# EAGLE design maplemini-r2 (EAGLE 5.11)
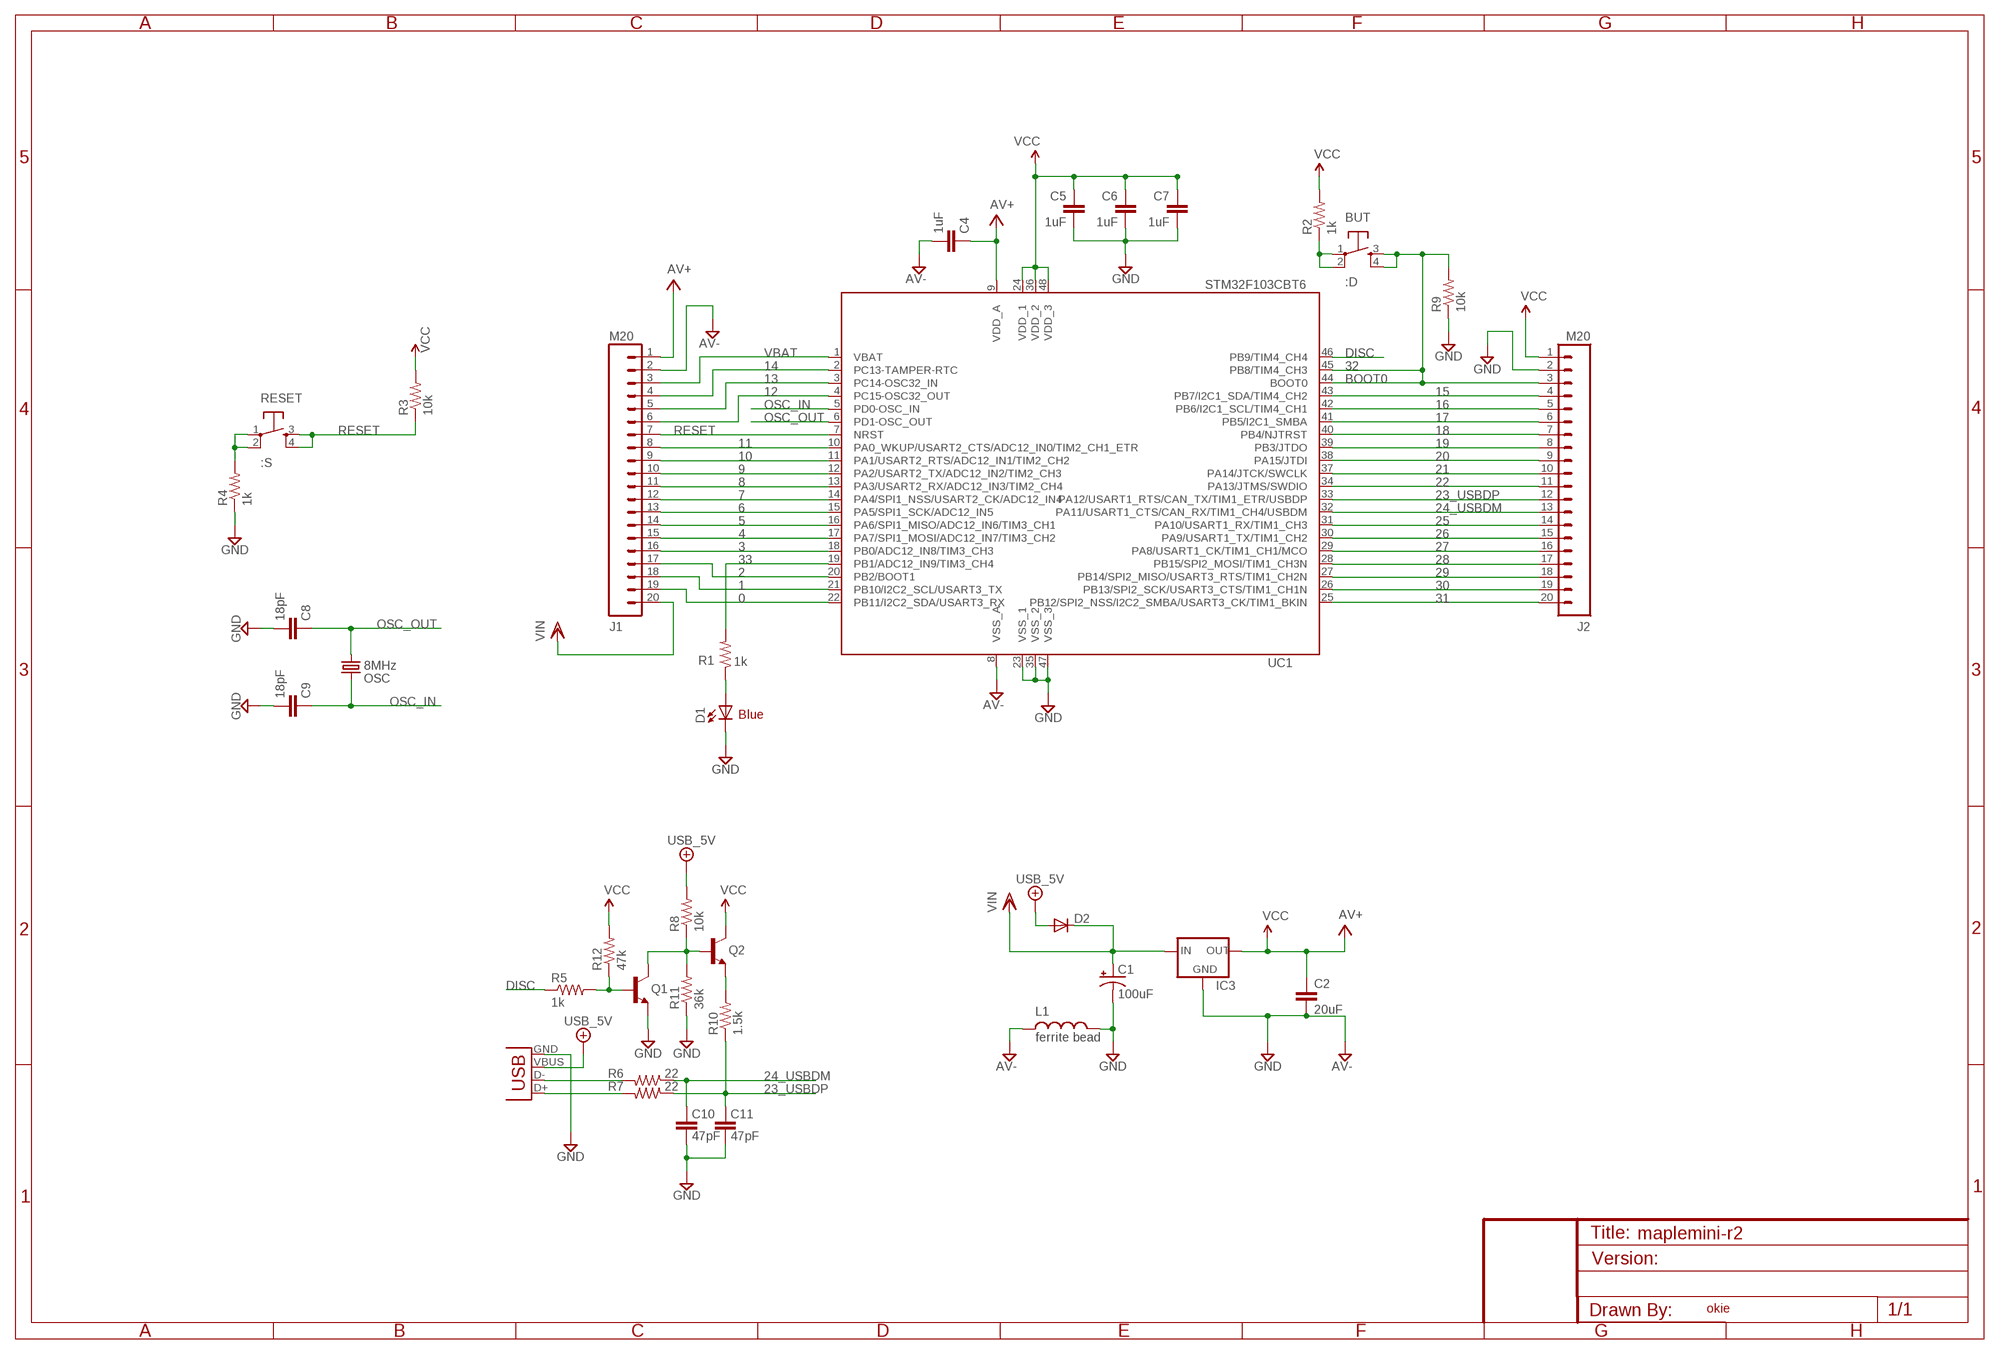
[diagram p0: schematic, sheet 1]

## Parts
BUT  :D  TAC_SWITCHPTH  [TACTILE-PTH]
C1  100uF  CAP_POLPTH2  [CPOL-RADIAL-10UF-25V]
C2  20uF  CAPPTH  [CAP-PTH-SMALL]
C4  1uF  CAP0603  [0603]
C5  1uF  CAP0603  [0603]
C6  1uF  CAP0603  [0603]
C7  1uF  CAP0603  [0603]
C8  18pF  CAP0603  [0603]
C9  18pF  CAP0603  [0603]
C10  47pF  CAP0603  [0603]
C11  47pF  CAP0603  [0603]
D1  Blue  LED3MM  [LED3MM]
D2  DIODE1N4148  [DIODE-1N4148]
IC3  MCP1700INLINE  [TO92-INLINE]
J1  M20  [1X20]
J2  M20  [1X20]
L1  ferrite bead  INDUCTOR0603  [0603]
OSC  8MHz  CRYSTALSMD  [HC49UP]
Q1  NPN-BJT  TRANSISTOR_NPNSOT23  [SOT23]
Q2  NPN-BJT  TRANSISTOR_NPNSOT23  [SOT23]
R1  1k  RESISTOR0603  [0603]
R2  1k  RESISTOR0603  [0603]
R3  10k  RESISTOR0603  [0603]
R4  1k  RESISTOR0603  [0603]
R5  1k  RESISTOR0603  [0603]
R6  22  RESISTOR0603  [0603]
R7  22  RESISTOR0603  [0603]
R8  10k  RESISTOR0603  [0603]
R9  10k  RESISTOR0603  [0603]
R10  1.5k  RESISTOR0603  [0603]
R11  36k  RESISTOR0603  [0603]
R12  47k  RESISTOR0603  [0603]
RESET  :S  TAC_SWITCHPTH  [TACTILE-PTH]
UC1  STM32F103CBT6  STM32F103CB  [LQFP48]
X1  USB-MINIB  USBPTH  [USB-B-PTH]

## Nets
0: J1.19 UC1.22(PB11/I2C2_SDA/USART3_RX)
1: J1.18 UC1.21(PB10/I2C2_SCL/USART3_TX)
2: J1.17 UC1.20(PB2/BOOT1)
3: J1.16 UC1.18(PB0/ADC12_IN8/TIM3_CH3)
4: J1.15 UC1.17(PA7/SPI1_MOSI/ADC12_IN7/TIM3_CH2)
5: J1.14 UC1.16(PA6/SPI1_MISO/ADC12_IN6/TIM3_CH1)
6: J1.13 UC1.15(PA5/SPI1_SCK/ADC12_IN5)
7: J1.12 UC1.14(PA4/SPI1_NSS/USART2_CK/ADC12_IN4)
8: J1.11 UC1.13(PA3/USART2_RX/ADC12_IN3/TIM2_CH4)
9: J1.10 UC1.12(PA2/USART2_TX/ADC12_IN2/TIM2_CH3)
10: J1.9 UC1.11(PA1/USART2_RTS/ADC12_IN1/TIM2_CH2)
11: J1.8 UC1.10(PA0_WKUP/USART2_CTS/ADC12_IN0/TIM2_CH1_ETR)
12: J1.6 UC1.4(PC15-OSC32_OUT)
13: J1.5 UC1.3(PC14-OSC32_IN)
14: J1.4 UC1.2(PC13-TAMPER-RTC)
15: J2.4 UC1.43(PB7/I2C1_SDA/TIM4_CH2)
16: J2.5 UC1.42(PB6/I2C1_SCL/TIM4_CH1)
17: J2.6 UC1.41(PB5/I2C1_SMBA)
18: J2.7 UC1.40(PB4/NJTRST)
19: J2.8 UC1.39(PB3/JTDO)
20: J2.9 UC1.38(PA15/JTDI)
21: J2.10 UC1.37(PA14/JTCK/SWCLK)
22: J2.11 UC1.34(PA13/JTMS/SWDIO)
23_USBDP: C11.2 J2.12 R7.1 R10.1 UC1.33(PA12/USART1_RTS/CAN_TX/TIM1_ETR/USBDP)
24_USBDM: C10.2 J2.13 R6.1 UC1.32(PA11/USART1_CTS/CAN_RX/TIM1_CH4/USBDM)
25: J2.14 UC1.31(PA10/USART1_RX/TIM1_CH3)
26: J2.15 UC1.30(PA9/USART1_TX/TIM1_CH2)
27: J2.16 UC1.29(PA8/USART1_CK/TIM1_CH1/MCO)
28: J2.17 UC1.28(PB15/SPI2_MOSI/TIM1_CH3N)
29: J2.18 UC1.27(PB14/SPI2_MISO/USART3_RTS/TIM1_CH2N)
30: J2.19 UC1.26(PB13/SPI2_SCK/USART3_CTS/TIM1_CH1N)
31: J2.20 UC1.25(PB12/SPI2_NSS/I2C2_SMBA/USART3_CK/TIM1_BKIN)
32: BUT.3 BUT.4 J2.3 R9.2 UC1.44(BOOT0) UC1.45(PB8/TIM4_CH3)
33: R1.2 UC1.19(PB1/ADC12_IN9/TIM3_CH4)
+5V/2: D2.A R8.2 X1.VBUS ; supply symbol labelled USB_5V
AV+: C4.1 J1.1 UC1.9(VDD_A)
AV-: C4.2 J1.2 L1.1 UC1.8(VSS_A)
DGND: C1.2(-) C2.2 C5.2 C6.2 C7.2 C8.2 C9.2 C10.1 C11.1 D1.K(C) IC3.1(GND) J2.2 L1.2 Q1.2(E) R4.1 R9.1 R11.1 UC1.23(VSS_1) UC1.35(VSS_2) UC1.47(VSS_3) X1.GND ; supply symbol labelled GND, AV-
DISC: R5.1 UC1.46(PB9/TIM4_CH4)
N$1: BUT.1 BUT.2 R2.1
N$2: D1.A R1.1
N$4: R4.2 RESET.1 RESET.2
N$51: Q2.2(E) R10.2
N$59: R6.2 X1.D-
N$60: R7.2 X1.D+
N$71: Q1.3(C) Q2.1(B) R8.1 R11.2
N$73: Q1.1(B) R5.2 R12.1
OSC_IN: C9.1 OSC.2 UC1.5(PD0-OSC_IN)
OSC_OUT: C8.1 OSC.1 UC1.6(PD1-OSC_OUT)
RESET: J1.7 R3.1 RESET.3 RESET.4 UC1.7(NRST)
VBAT: J1.3 UC1.1(VBAT)
VCC: C2.1 C5.1 C6.1 C7.1 IC3.3(OUT) J2.1 Q2.3(C) R2.2 R3.2 R12.2 UC1.24(VDD_1) UC1.36(VDD_2) UC1.48(VDD_3) ; supply symbol labelled AV+
VIN: C1.1(+) D2.C IC3.2(IN) J1.20

## Notes on the sheet
- BOOT0
- Blue
- okie

## Library data of the parts
BUT RESET = 3d2011:TAC_SWITCH: Momentary Switch Button commonly used for reset or general input. Spark Fun Electronics SKU : COM-00097
C1 = SparkFun3:CAP_POL: Capacitor Polarized These are standard SMD and PTH capacitors. Normally 10uF, 47uF, and 100uF in electrolytic and tantalum varieties. Always verify the external diameter of the through hole cap, it varies with capacity, voltage, and manufacturer. The EIA devices should be standard.
C2 = SparkFun2:CAP: Capacitor Standard 0603 ceramic capacitor, and 0.1" leaded capacitor.
C4-C11 = SparkFun:CAP: Capacitor Standard 0603 ceramic capacitor, and 0.1" leaded capacitor.
D1 = SparkFun:LED: LEDs Standard schematic elements and footprints for 5mm, 3mm, 1206, and 0603 sized LEDs. 5mm - Spark Fun Electronics SKU : COM-00529 (and others)
D2 = SparkFun3:DIODE: Diode These are standard reverse protection diodes and small signal diodes. SMA package can handle up to about 1A. SOD-323 can handle about 200mA. What the SOD-323 package when ordering, there are some mfgs out there that are 5-pin packages.
IC3 = adafruit:MCP1700: VOLTAGE REGULATOR
J1 J2 = SparkFun3:M20: This is just like the LOCK variant in that the holes are staggared by 5 mil, but except for the last two holes. They are not altered from the "standard" footprint layout. This is used for a special purpose on the layout of our Graphic LCD Backpack. Make sure you want to use this device before selecting it for you project!
L1 = SparkFun3:INDUCTOR: Inductors Basic Inductor/Choke - 0603 and 1206. Footprints are not proven and vary greatly between part numbers.
OSC = SparkFun2:CRYSTAL: Crystals Various standard crystals. Proven footprints. Spark Fun Electronics SKU : COM-00534
Q1 Q2 = SparkFun2:TRANSISTOR_NPN: Transistor NPN BJT configuration in SOT23 package. MMBT2222 is the common NPN we use. Double check BCE configuration again layout.
R1-R12 = SparkFun:RESISTOR: Resistor Basic schematic elements and footprints for 0603, 1206, and PTH 1/10th watt (small) resistors.
UC1 = stm32:STM32F103CB
X1 = SparkFun2:USB: USB Connectors USB-B-PTH is fully proven SKU : PRT-00139 USB-miniB is fully proven SKU : PRT-00587 USB-A-PCB is untested. USB-A-H is throughly reviewed, but untested. Spark Fun Electronics SKU : PRT-00437 USB-B-SMT is throughly reviewed, but untested. Needs silkscreen touching up. USB-A-S has not been used/tested USB-MB-H has not been used/tested

## Net classes
1 vcc: width 0.254 mm

## Board
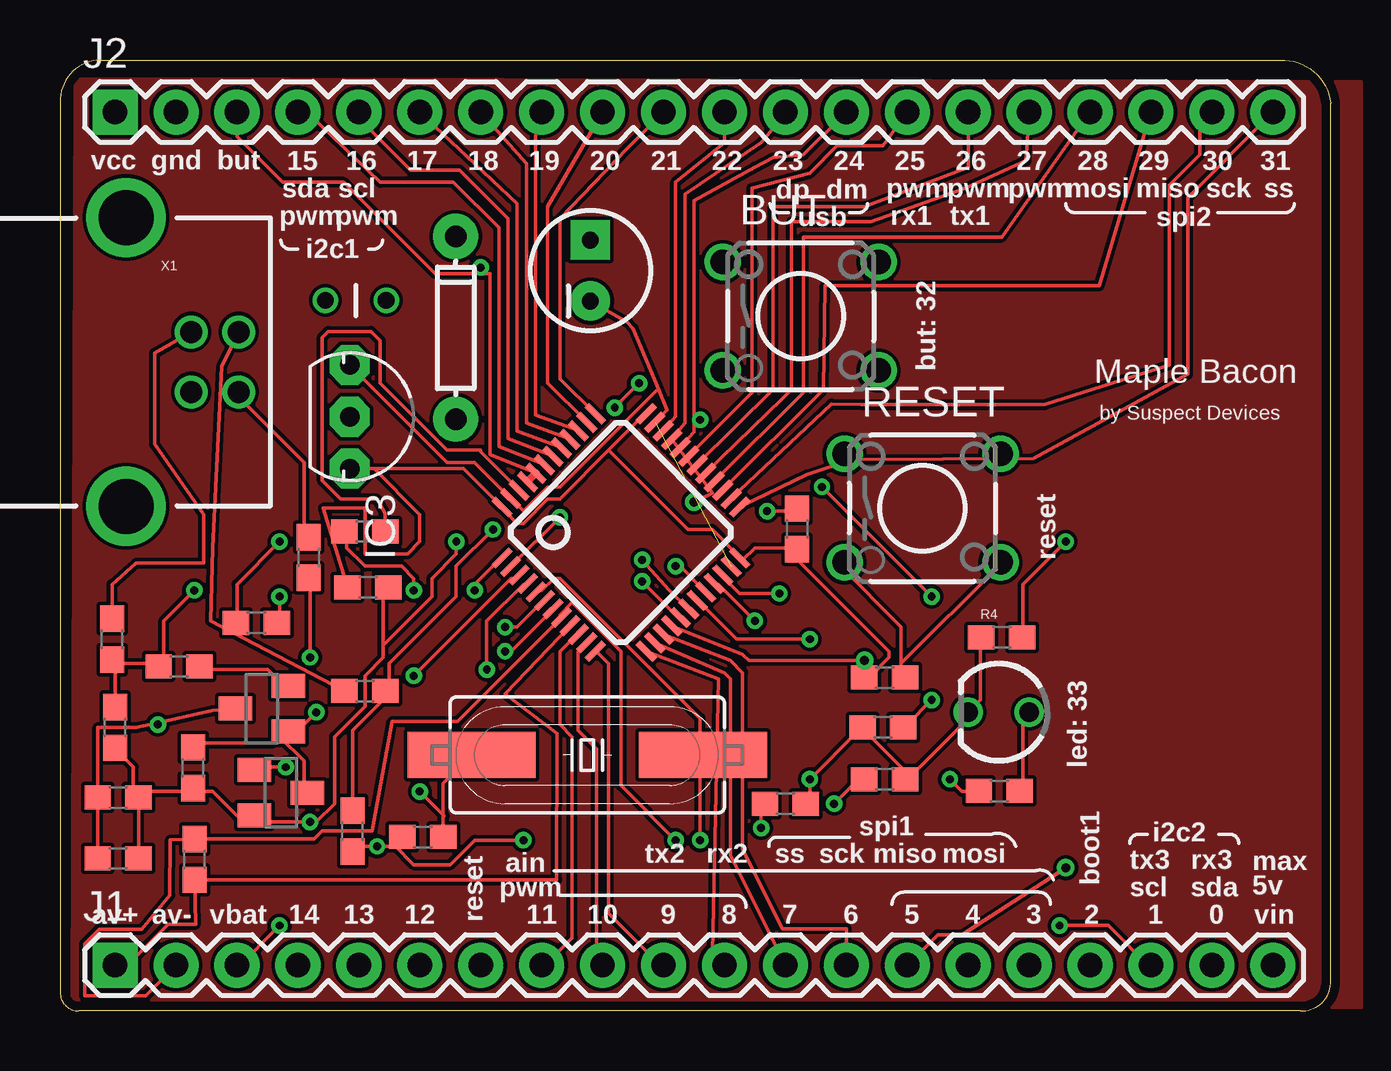
[diagram p1: board, top side]
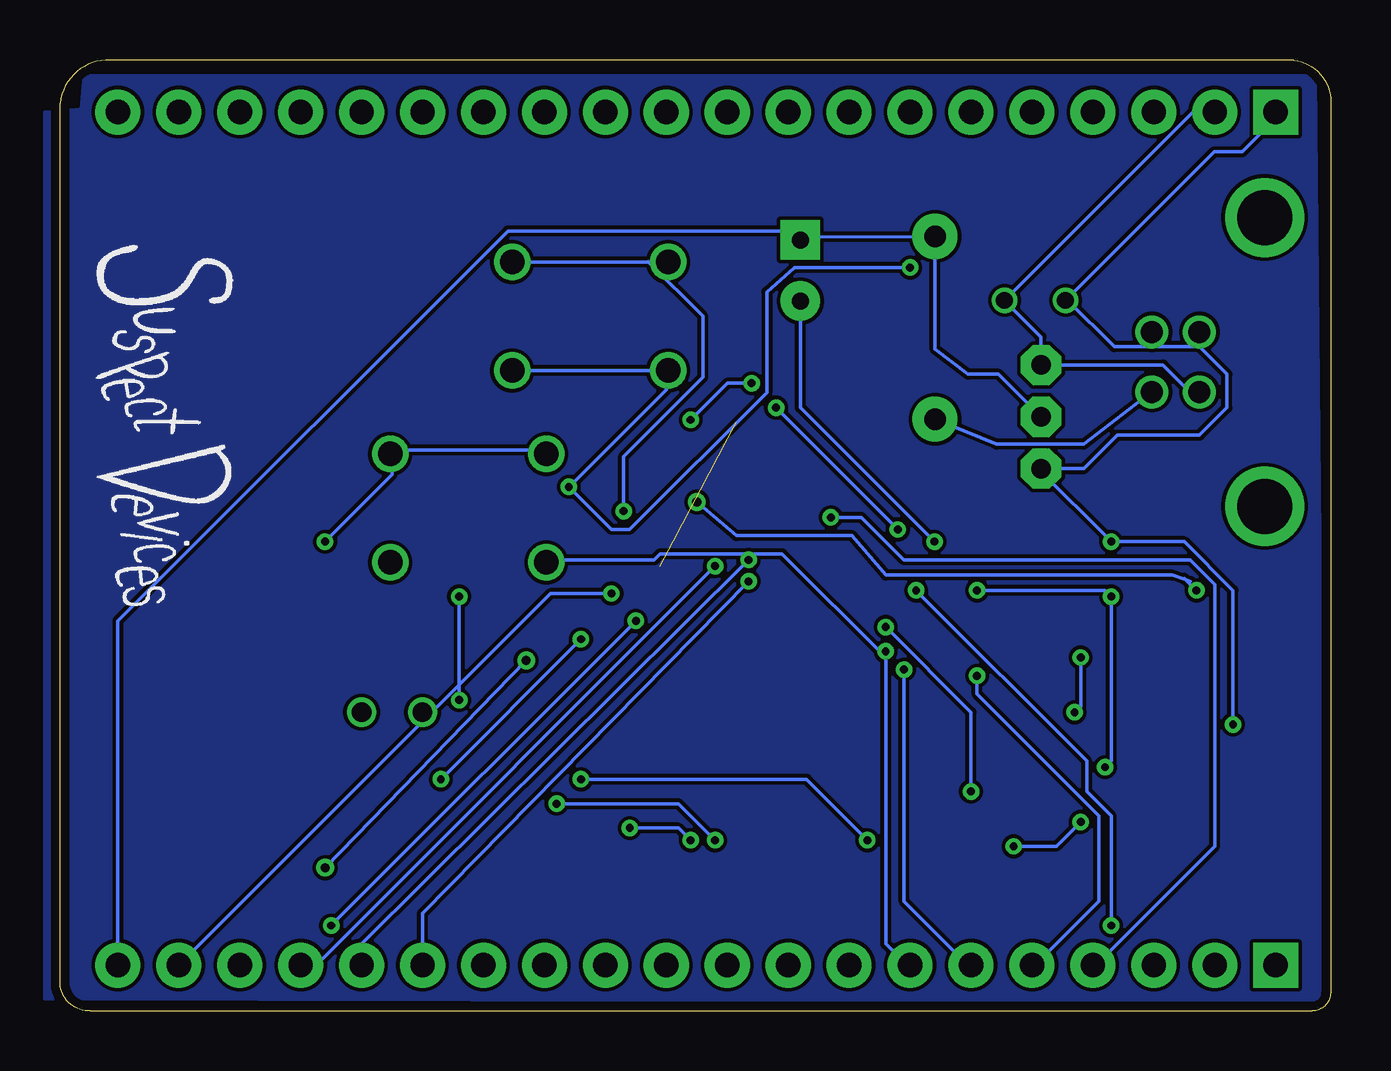
[diagram p2: board, bottom side, seen from below]

Size 52.97 x 39.64 mm. Coordinates in mm from the lower left corner, seen from the top.
Outline: 1.53,39.62 50.68,39.62 arc-90 52.97,37.85 52.97,1.14 arc-90 51.7,0 0.77,0 arc-90 0.01,0.76 0.01,37.72 arc-90 1.53,39.62
Copper layers (1*16): Top 0.0356mm / dielectric 1.5011mm / Bottom 0.0356mm
Design rules "LaenPCBOrder": minimum track width 6mil, minimum drill 13mil, track to track 6mil, track to pad 6mil, pad to pad 6mil, via to via 6mil, smd to smd 6mil, copper to edge 15mil, drill to drill 6mil, minimum pad ring 7mil, minimum via ring 7mil, stop-mask expansion 4mil, vias tented up to drill 0mil, thermal gap 10mil

### Footprints (pad centres in the part's own frame; a part is rotated, then mirrored left to right if it is on the bottom)
TACTILE-PTH = drill 1.016 round: 1 -3.251,2.261; 2 3.251,2.261; 3 -3.251,-2.261; 4 3.251,-2.261
CPOL-RADIAL-10UF-25V = drill 0.7 pad 1.651 square: 1 1.27,0 | drill 0.7 pad 1.651 round: 2 -1.27,0
CAP-PTH-SMALL = drill 0.7 round: 1 0,0; 2 2.54,0
0603 = smd 1.1 x 1: 1 -0.85,0; 2 0.85,0
LED3MM = drill 0.813 round: A -1.27,0; K 1.27,0
DIODE-1N4148 = drill 0.9 pad 1.88 round: A -3.81,0; C 3.81,0
TO92-INLINE = drill 0.813 pad 1.676 octagon: 1 -2.159,0; 2 0,0; 3 2.159,0
1X20 = drill 1.016 pad 1.88 square: 1 0,0 | drill 1.016 pad 1.88 round: 2 2.54,0; 3 5.08,0; 4 7.62,0; 5 10.16,0; 6 12.7,0; 7 15.24,0; 8 17.78,0; 9 20.32,0; 10 22.86,0; 11 25.4,0; 12 27.94,0; 13 30.48,0; 14 33.02,0; 15 35.56,0; 16 38.1,0; 17 40.64,0; 18 43.18,0; 19 45.72,0; 20 48.26,0
HC49UP = smd 5.334 x 1.93: 1 -4.826,0; 2 4.826,0
SOT23 = smd 1 x 1.4: 1 -0.95,-1.1; 2 0.95,-1.1; 3 0,1.1
LQFP48 = smd 0.254 x 1: 1 -2.75,-4.25; 2 -2.25,-4.25; 3 -1.75,-4.25; 4 -1.25,-4.25; 5 -0.75,-4.25; 6 -0.25,-4.25; 7 0.25,-4.25; 8 0.75,-4.25; 9 1.25,-4.25; 10 1.75,-4.25; 11 2.25,-4.25; 12 2.75,-4.25; 25 2.75,4.25; 26 2.25,4.25; 27 1.75,4.25; 28 1.25,4.25; 29 0.75,4.25; 30 0.25,4.25; 31 -0.25,4.25; 32 -0.75,4.25; 33 -1.25,4.25; 34 -1.75,4.25; 35 -2.25,4.25; 36 -2.75,4.25 | smd 1 x 0.254: 13 4.25,-2.75; 14 4.25,-2.25; 15 4.25,-1.75; 16 4.25,-1.25; 17 4.25,-0.75; 18 4.25,-0.25; 19 4.25,0.25; 20 4.25,0.75; 21 4.25,1.25; 22 4.25,1.75; 23 4.25,2.25; 24 4.25,2.75; 37 -4.25,2.75; 38 -4.25,2.25; 39 -4.25,1.75; 40 -4.25,1.25; 41 -4.25,0.75; 42 -4.25,0.25; 43 -4.25,-0.25; 44 -4.25,-0.75; 45 -4.25,-1.25; 46 -4.25,-1.75; 47 -4.25,-2.25; 48 -4.25,-2.75
USB-B-PTH = drill 0.914 round: D+ 0,1.25; D- 1.981,1.25; GND 0,-1.25; VBUS 1.981,-1.25 | drill 2.286 round: P$1 -2.718,-6.02; P$2 -2.718,6.02

### Placement (x,y rotation side)
BUT  30.87,28.96 0 top
C1  22.11,30.86 90 top
C2  11.06,29.62 0 top
C4  5.61,6.31 90 top
C5  12.84,17.65 0 top
C6  2.42,8.89 0 top
C7  2.42,6.35 0 top
C8  15.12,7.25 180 top
C9  30.24,8.64 0 top
C10  12.2,7.49 90 top
C11  2.3,11.81 90 top
D1  39.13,12.45 180 top
D2  16.49,28.47 90 top
IC3  12.08,24.77 270 top
J1  2.3,1.91 0 top
J2  2.3,37.47 0 top
L1  34.38,9.65 0 top
OSC  21.98,10.67 0 top
Q1  9.21,9.09 270 top
Q2  8.42,12.6 90 top
R1  39.15,9.17 180 top
R2  30.72,20.09 270 top
R3  34.38,13.89 180 top
R4  39.25,15.57 0 top
R5  12.71,19.99 180 top
R6  12.71,13.34 180 top
R7  2.17,15.49 90 top
R8  10.37,18.9 90 top
R9  34.3,11.81 0 top
R10  4.96,14.35 0 top
R11  5.55,10.14 90 top
R12  8.19,16.18 180 top
RESET  35.95,20.96 0 top
U$1  [SUSDEVLOGOSM]  51.19,32 270 bottom
UC1  23.38,19.94 315 top
X1  5.47,27.05 0 top

### Tracks (layer width: path | path; a pad name or v marks a point on that pad's centre or on a via)
0  (via drill 0.33)
  Top 0.152: UC1.22 27.62,18.11 28.33,17.4 v29.98,17.4
  Bottom 0.152: v29.98,17.4 32.52,17.4 J1.19
1  (via drill 0.33)
  Top 0.152: v28.97,16.26 27.44,17.78 UC1.21 | v41.67,3.56 43.7,3.56 45.48,1.78 J1.18
  Bottom 0.152: v41.67,3.56 v28.97,16.26
2  (via drill 0.33)
  Top 0.152: v25.66,18.54 25.84,18.54 UC1.20
  Bottom 0.152: J1.17 42.3,1.91 v25.66,18.54
3  (via drill 0.33)
  Top 0.152: v24.27,18.8 25.41,17.53 26.17,16.76 UC1.18
  Bottom 0.152: v24.27,18.8 40.4,2.79 J1.16
4  (via drill 0.33)
  Top 0.152: v24.27,17.91 25.66,16.51 UC1.17
  Bottom 0.152: v24.27,17.91 37.86,4.06 J1.15
5  (via drill 0.38)
  Top 0.152: v33.54,14.61 28.71,14.61 28.46,14.86 UC1.16 | v41.92,5.97 37.6,3.18 36.59,3.18 J1.14
  Bottom 0.152: v41.92,5.97 v33.54,14.61
6
  Top 0.152: J1.13 32.78,3.43 30.11,3.43 28.46,6.73 28.46,14.1 27.95,14.61 UC1.15
7
  Top 0.152: J1.12 27.95,6.48 27.95,13.84 27.7,14.1 UC1.14
8
  Top 0.152: J1.11 27.19,2.41 27.44,13.84 UC1.13
9
  Top 0.152: UC1.12 22.36,14.99 22.87,14.48 22.87,4.06 25.16,1.78 J1.10
10
  Top 0.152: UC1.11 21.85,15.24 21.6,14.99 21.6,11.68 22.36,10.92 22.36,2.29 22.62,2.03 J1.9
11
  Top 0.152: UC1.10 21.6,15.75 20.84,14.99 20.84,11.94 21.35,11.43 21.35,3.05 20.08,1.78 J1.8
12  (via drill 0.33)
  Top 0.152: v17.79,14.22 17.79,16.26 19.31,17.78 UC1.4
  Bottom 0.152: v17.79,14.22 17.79,4.57 15,1.78 J1.6
13  (via drill 0.33)
  Top 0.152: v14.74,13.97 18.81,18.03 19.06,18.03 UC1.3
  Bottom 0.152: v14.74,13.97 14.74,13.21 9.66,8.13 9.66,4.57 12.46,1.78 J1.5
14  (via drill 0.33)
  Top 0.152: v20.84,20.57 18.81,18.54 UC1.2
  Bottom 0.152: v20.84,20.57 19.57,20.57 17.79,18.8 5.85,18.8 4.84,17.78 4.84,6.86 9.92,1.78 J1.4
15
  Top 0.152: UC1.43 18.3,23.52 18.3,32.64 16.39,34.54 13.35,34.54 10.3,37.47 J2.4
16
  Top 0.152: UC1.42 18.68,23.85 18.68,33.02 16.65,35.05 14.62,35.05 12.46,37.21 J2.5
17
  Top 0.152: UC1.41 19.06,24.18 19.06,33.66 17.28,35.31 J2.6
18
  Top 0.152: UC1.40 19.44,24.5 19.44,35.31 J2.7
19
  Top 0.152: UC1.39 19.82,24.83 19.82,36.45 J2.8
20
  Top 0.152: UC1.38 20.33,26.17 20.33,33.53 J2.9
21
  Top 0.152: UC1.37 20.84,26.33 20.84,33.02 23.63,35.94 J2.10
22
  Top 0.152: J2.11 27.7,36.2 25.66,34.54 25.66,24.77 UC1.34
23_USBDP  (via drill 0.33, 0.38)
  Top 0.152: J2.12 29.35,36.32 29.22,36.2 26.05,34.04 26.05,24.51 UC1.33 27.2,21.59 v26.43,21.21 | C11.2 2.3,14.48 | 2.3,14.48 4.07,14.48 R10.1 4.33,14.48 4.33,16.26 v5.6,17.53 | 2.3,14.48 R7.1
  Bottom 0.152: 6.12,18 6.61,18.16 18.55,18.16 19.95,19.81 24.78,19.81 v26.43,21.21 | 6.12,18 5.85,17.91 | v5.6,17.53 6.11,18.03 6.12,18
24_USBDM  (via drill 0.33)
  Top 0.152: 26.43,24.64 26.43,24.13 UC1.32 | 26.43,24.64 26.43,33.78 28.97,35.18 29.73,35.56 31,35.69 J2.13 | C10.2 12.2,11.68 13.73,13.21 R6.1 13.73,13.46 13.73,14.48 16.52,17.27 16.52,18.54 v18.04,20.07 | v23.12,25.15 v24.14,26.16 | v26.68,24.64 26.43,24.64
  Bottom 0.152: v18.04,20.07 v23.12,25.15 | v24.14,26.16 25.16,26.16 v26.68,24.64
25
  Top 0.152: UC1.31 28.84,25.78 28.84,34.29 31.25,34.93 32.4,36.07 34.3,36.07 J2.14
26
  Top 0.152: J2.15 37.86,35.18 37.22,34.93 33.54,33.53 29.73,33.53 29.73,25.91 UC1.30
27
  Top 0.152: J2.16 40.27,35.43 37.73,34.29 33.79,32.89 30.49,32.89 30.49,25.91 30.11,25.53 UC1.29
28
  Top 0.152: UC1.28 31,25.78 31,32.26 39.25,32.26 J2.17
29
  Top 0.152: J2.18 43.32,30.23 31.89,30.23 31.82,25.91 UC1.27
30
  Top 0.152: UC1.26 32.17,25.3 33.41,25.27 41.03,25.27 46.24,26.92 46.24,34.42 47.51,35.69 47.51,36.96 J2.19
31
  Top 0.152: UC1.25 31.13,22.35 33.03,22.99 40.57,23.03 47,26.54 47,33.91 J2.20
32  (via drill 0.33)
  Top 0.152: UC1.44 17.92,23.2 17.92,30.73 17.54,30.73 | 17.54,30.73 15.63,30.73 11.82,34.54 9.28,34.54 7.38,36.45 J2.3 | v36.33,12.95 35.32,11.94 R9.2 | v31.76,21.84 v36.33,17.27 | 17.54,30.73 v17.54,30.99
  Top 0.305: UC1.45 UC1.44
  Bottom 0.152: BUT.4 BUT.3 27.7,26.67 27.7,25.91 v31.76,21.84 29.98,20.07 29.22,20.07 23.51,25.78 23.51,29.97 22.36,30.99 v17.54,30.99 | v36.33,17.27 v36.33,12.95
33  (via drill 0.33)
  Top 0.152: v31.25,15.49 28.2,15.49 26.68,17.02 UC1.19 | v37.09,9.65 37.6,9.14 38.11,9.14 R1.2
  Bottom 0.152: v31.25,15.49 v37.09,9.65
+5V/2
  Top 0.152: R8.2 10.17,19.81 10.17,22.86 7.38,25.65 X1.VBUS
  Bottom 0.152: X1.VBUS 7.58,25.71 10.3,23.62 13.93,23.62 D2.A
AV+
  Top 0.152: J1.1 3.06,2.16 4.51,3.61 5.65,3.61 C4.1 20.7,5.46 20.71,11.56 18.54,13.21 UC1.9
AV-  (via drill 0.33)
  Top 0.152: J1.2 3.57,0.64 1.03,0.64 1.03,2.79 1.64,3.4 3.41,3.4 4.58,4.83 4.6,7.13 C4.2 10.6,7.16 10.93,7.49 13.01,7.49 13.85,12.07 16.57,12.07 UC1.8 20.84,16.51 21.35,17.02 23.38,14.99 23.38,9.4 v25.66,7.11 | v32.27,8.64 33.28,9.65 L1.1
  Bottom 0.152: v32.27,8.64 27.19,8.64 v25.66,7.11
DGND  (via drill 0.33)  (1 unrouted)
  Top 0.152: C1.2 23.63,28.7 23.89,28.45 24.94,25.92 | 24.94,25.92 25.31,25.04 UC1.35 | C7.2 C6.2 | IC3.1 16.14,22.86 17.28,22.86 UC1.47 18.81,21.34 19.31,20.83 20.33,21.84 20.84,21.84 24.9,25.91 24.94,25.92 | C9.2 31.25,8.64 v31.25,9.65 33.28,11.68 R9.1 33.54,11.68 35.06,10.16 35.06,9.65 L1.2 35.32,9.65 37.86,12.19 D1.K 38.36,12.95 38.36,15.49 R4.1 | C6.2 3.31,8.89 3.57,9.14 5.34,9.14 R11.1 5.6,9.14 6.36,9.14 7.38,8.13 7.88,8.13 Q1.2 8.14,8.13 8.39,7.87 v10.42,7.87 10.68,7.87 11.44,8.64 11.44,11.43 12.71,12.7 12.71,13.97 13.47,14.73 13.47,15.24 | C11.1 2.3,10.92 3.06,10.16 3.06,8.89 C6.2 | 13.98,6.86 v13.22,6.86 12.2,6.86 C10.1 | 13.98,6.86 14.23,7.11 C8.2 13.98,6.86 | 13.47,15.24 13.47,17.53 C5.2 | v16.52,19.56 16.52,19.05 15.5,18.03 15.5,17.27 13.47,15.24 | v19.31,7.11 17.28,7.11 16.27,6.1 14.74,6.1 13.98,6.86
  Bottom 0.152: J2.2 5.75,37.47 C2.2 12.08,28.09 IC3.1 7,26.92 5.87,25.8 X1.GND | v13.22,6.86 11.44,6.86 v10.42,7.87 | v16.52,19.56 22.11,25.15 C1.2 | v31.25,9.65 21.85,9.65 v19.31,7.11
DISC
  Top 0.152: R5.1 13.56,20.74 13.22,21.34 11.69,21.34 10.93,22.1 10.93,28.07 11.19,28.32 12.96,28.32 13.35,27.94 13.35,26.16 16.14,23.37 17.54,23.37 17.54,23.31 UC1.46
GND
  pour Bottom: 0.26,0.38 0.65,38.99 51.95,38.99 52.08,37.59 53.6,37.47 53.6,0.51
  pour Top: 0.52,0.25 0.65,38.86 54.24,38.74 54.24,0.13
N$1  (via drill 0.33)
  Top 0.152: v29.47,20.83 30.49,20.83 R2.1
  Bottom 0.152: 28.46,31.22 BUT.1 | 28.46,31.22 BUT.2 | v29.47,20.83 29.47,23.11 26.17,26.42 26.17,28.96 28.46,31.24 28.46,31.22
N$2
  Top 0.152: D1.A 40.14,12.19 40.14,9.4 R1.1
N$4  (via drill 0.33)
  Top 0.152: v41.92,19.56 40.14,17.78 40.14,15.75 R4.2
  Bottom 0.152: v41.92,19.56 39.13,22.35 39.13,23.11 RESET.2 39.13,23.37 32.78,23.37 RESET.1
N$51
  Top 0.152: R10.2 5.85,14.22 8.65,14.22 9.41,13.46 Q2.2
N$59
  Top 0.152: X1.D- 6.74,26.85 6.36,19.3 6.27,16.26 R6.2
N$60
  Top 0.152: X1.D+ 3.95,27.41 3.95,23.62 5.98,20.7 5.98,18.67 3.19,18.67 2.17,17.78 R7.2
N$71  (via drill 0.33)
  Top 0.152: 9.15,11.43 9.41,11.68 Q2.1 | 9.15,11.43 8.9,11.18 5.6,11.18 R11.2 | v10.42,14.73 10.42,18.03 R8.1 | v10.68,12.45 9.66,11.43 Q2.1 | 9.15,11.43 10.17,10.41 10.17,9.14 Q1.3 | 9.15,11.43 Q2.1
  Bottom 0.152: v10.42,14.73 10.42,12.7 v10.68,12.45
N$73  (via drill 0.33)
  Top 0.152: v9.15,17.27 9.15,16.26 R12.1 | v9.41,10.16 8.14,10.16 Q1.1 | v14.74,17.53 14.74,18.03 14.23,18.54 12.71,18.54 11.95,19.3 11.95,19.81 R5.2
  Bottom 0.152: v9.41,10.16 9.15,10.41 v9.15,17.27 9.41,17.53 v14.74,17.53
OSC_IN  (via drill 0.33)
  Top 0.152: 26.68,10.67 26.68,12.19 20.84,18.03 20.58,18.03 20.08,17.53 UC1.5 | v29.22,7.62 29.22,8.64 C9.1 | v26.68,7.11 26.68,10.67 | 26.68,10.67 OSC.2
  Bottom 0.152: v29.22,7.62 27.19,7.62 v26.68,7.11
OSC_OUT  (via drill 0.33)
  Top 0.152: C8.1 15.97,8.13 | 15.97,8.13 15.97,9.49 OSC.1 | v18.55,16 19.06,16 20.08,17.02 UC1.6 | v15,9.14 16.01,8.13 15.97,8.13
  Bottom 0.152: v18.55,16 15,12.45 v15,9.14
RESET  (via drill 0.33)
  Top 0.152: 35.06,14.48 35.06,16 32.52,18.54 RESET.3 | 35.06,14.48 35.06,13.97 R3.1 | 35.06,14.48 39.13,18.54 RESET.4 | v18.55,14.99 18.81,14.99 20.33,16.51 UC1.7
  Bottom 0.152: 18.55,14.73 18.55,2.79 17.54,1.78 J1.7 | 18.55,14.73 22.87,19.05 27.95,19.05 28.2,18.8 32.52,18.8 RESET.3 | 18.55,14.73 v18.55,14.99
VBAT  (via drill 0.33)
  Top 0.152: v17.28,17.53 17.28,17.78 18.3,18.8 UC1.1 | v9.15,3.56 7.38,1.78 J1.3
  Bottom 0.152: v17.28,17.53 10.17,10.41 10.17,9.14 9.15,8.13 v9.15,3.56
VCC  (via drill 0.33)
  Top 0.152: C7.1 C6.1 1.57,11.81 3.19,11.81 4.06,12.01 | C5.1 10.97,20.96 12.71,20.96 12.71,19.05 14.49,19.05 15,19.56 15,20.7 13.09,22.61 IC3.3 16.82,22.61 UC1.48 18.55,20.83 19.06,20.32 19.31,20.32 20.33,21.34 20.84,21.34 22.87,23.37 | 4.06,12.01 6.36,12.51 Q2.3 | R3.2 33.54,13.97 33.79,13.97 34.55,14.73 34.55,14.99 30.49,19.05 R2.2 30.49,19.3 28.97,19.3 28.46,18.8 UC1.24 28.2,19.05 27.19,20.07 26.17,20.07 22.87,23.37 | 22.87,23.37 24.39,24.89 UC1.36 | v9.15,19.56 7.38,17.78 7.38,16.26 R12.2 | 4.06,12.01 v4.07,11.94
  Bottom 0.152: J2.1 2.3,37.21 3.69,35.81 4.86,35.81 C2.1 10.96,29.62 9.03,27.69 5.47,27.69 4.33,26.54 4.33,25.15 5.47,24 8.9,24 10.3,22.61 IC3.3 12.2,22.61 v9.15,19.56 6.11,19.56 4.07,17.53 v4.07,11.94
VIN
  Bottom 0.152: 22.11,32.26 D2.C 16.5,27.58 15.12,26.54 13.85,26.54 IC3.2 | 22.11,32.26 22.36,32.51 34.3,32.51 50.56,16.26 J1.20 | 22.11,32.26 C1.1

### Text on the board
_tsilk: vcc | gnd | but | 15 | 16 | 17 | 18 | 19 | 20 | 21 | 22 | 23 | dp | 24 | dm | 25 | 26 | 27 | 28 | 29 | 30 | 31 | sda | scl | usb | pwm | pwm | pwm | mosi | miso | sck | spi2 | ss | pwm | pwm | rx1 | tx1 | i2c1 | but: 32 | Maple Bacon | by Suspect Devices | reset | led: 33 | boot1 | spi1 | i2c2 | ain | tx2 | rx2 | ss | sck | miso | mosi | tx3 | rx3 | max | pwm | scl | sda | 5v | av+ | av- | vbat | 14 | 13 | 12 | reset | 11 | 10 | 9 | 8 | 7 | 6 | 5 | 4 | 3 | 2 | 1 | 0 | vin